# Altium project iMX6 Rex Development Baseboard V1I1.PrjPcb (part 2 of 5)

## Sheet [09] - USB.SchDoc
size A2; DocumentNumber: 2; SheetNumber: 9; SheetTotal: 20
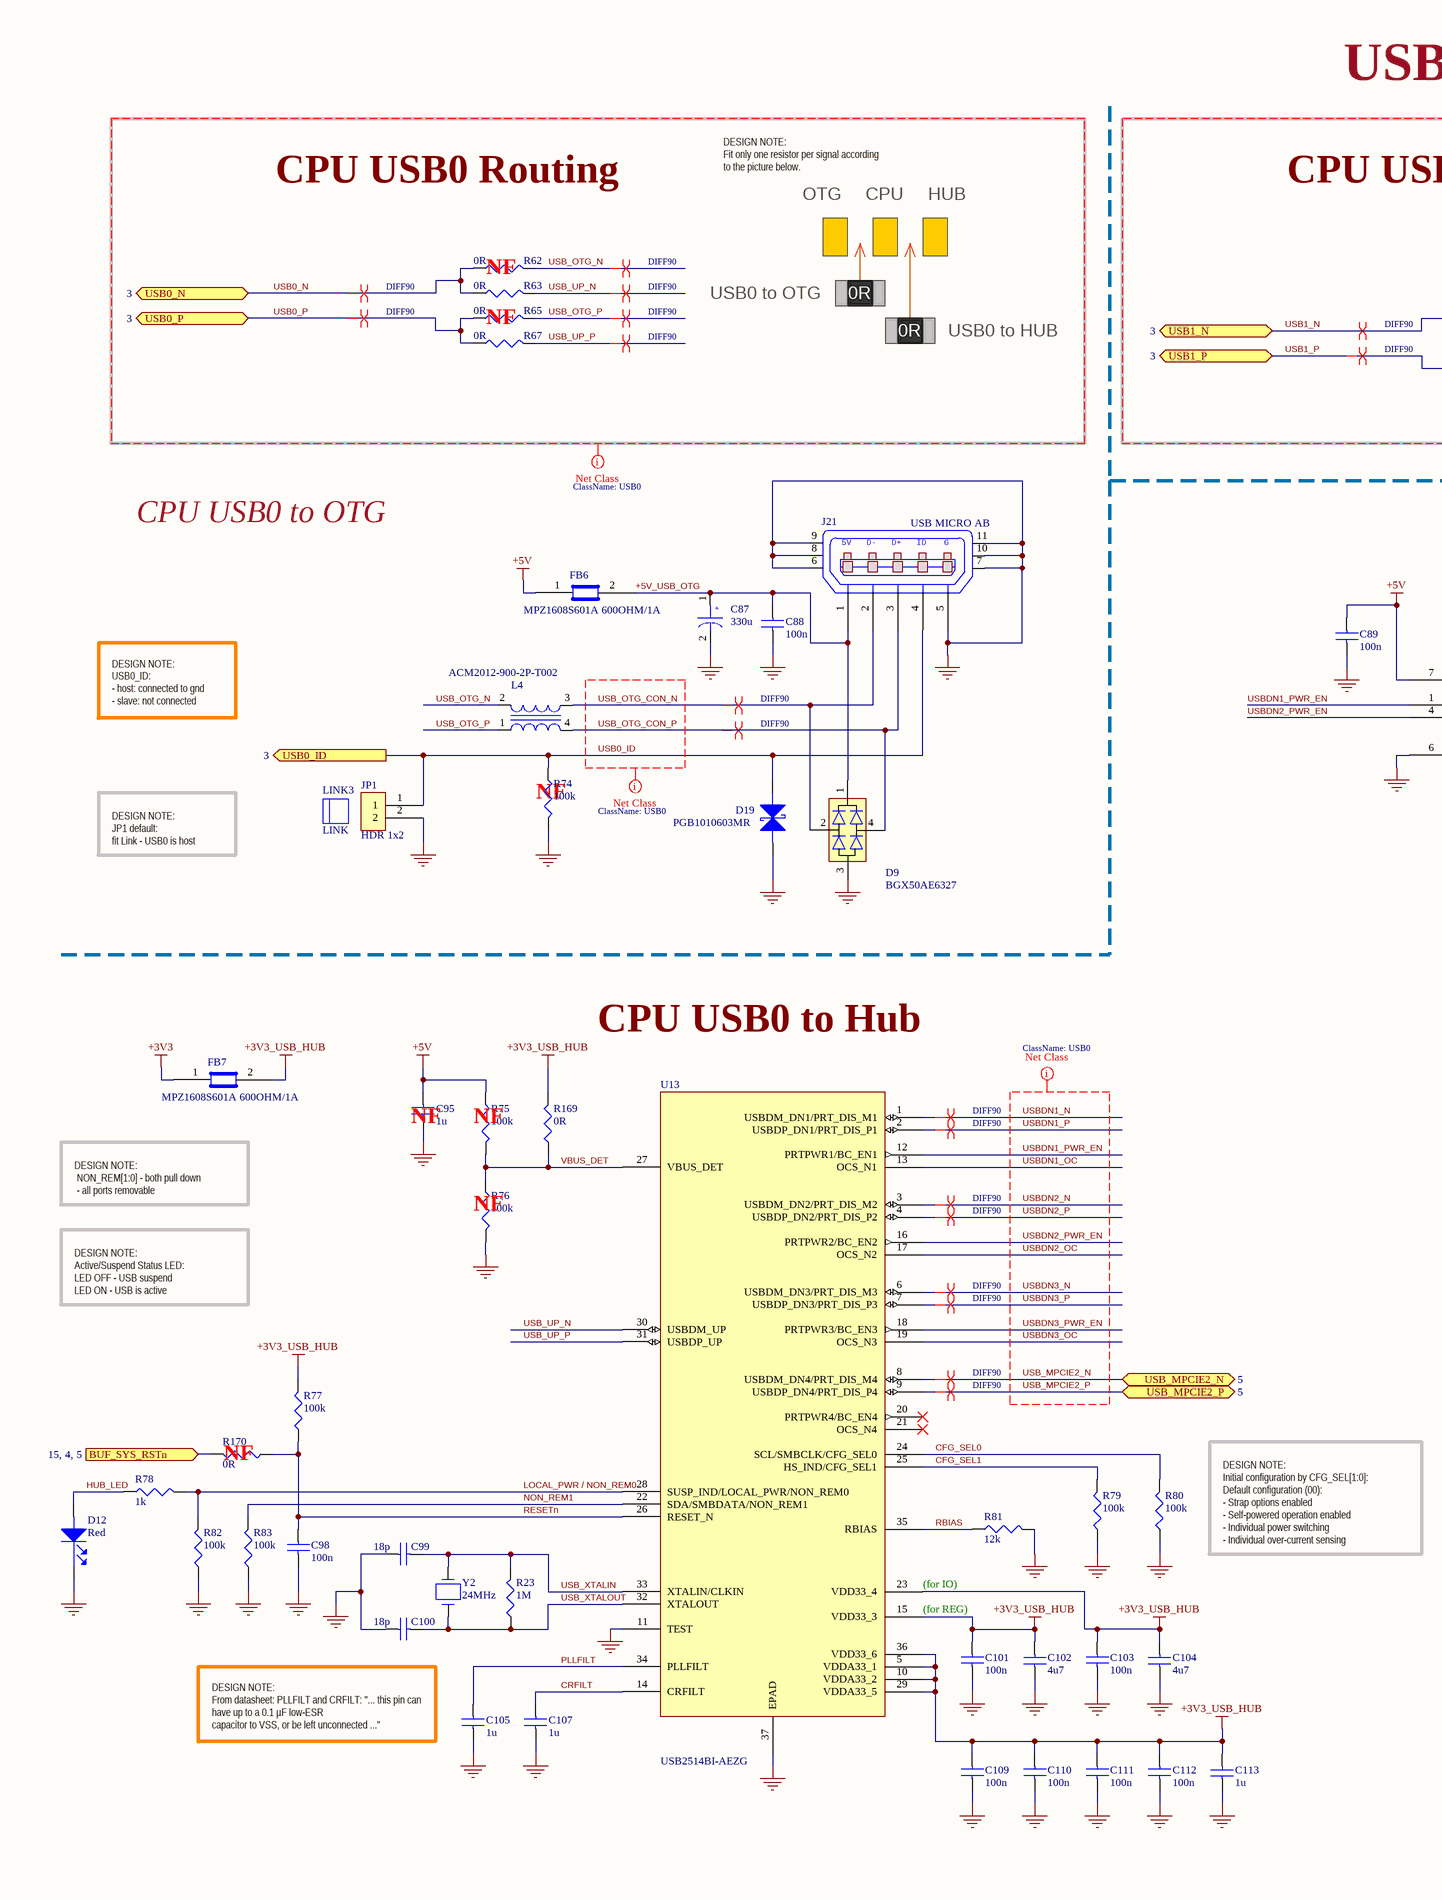
[diagram p4: [09] - USB.SchDoc, left]
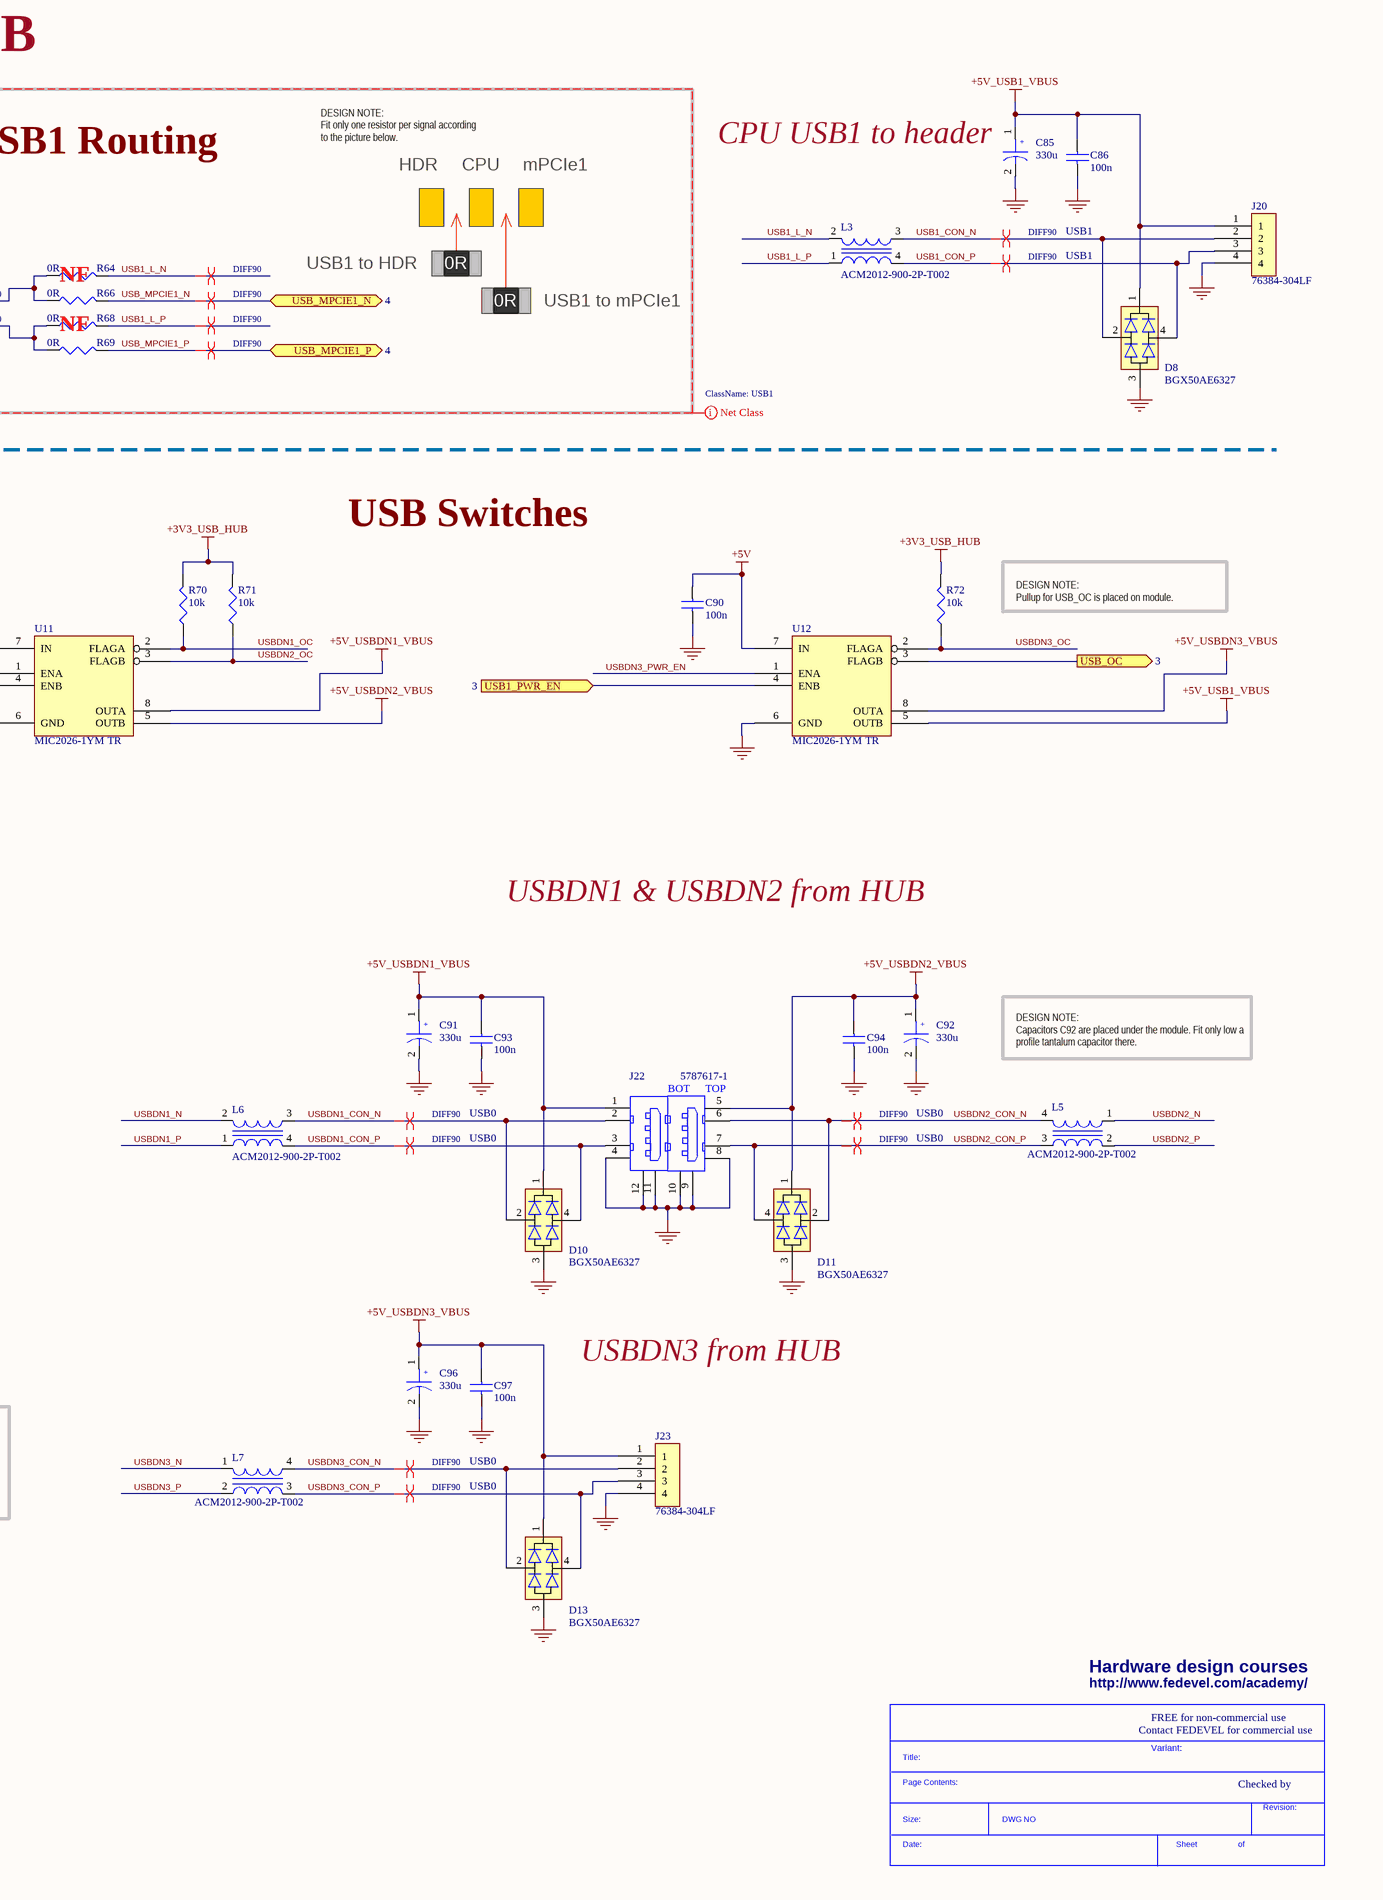
[diagram p5: [09] - USB.SchDoc, right]

### Parts
(Parts that share a designator on the sheet are numbered #1, #2 ... from top to bottom, then left to right.)
*#4  SDTitleBlock  (value not drawn)  (graphical)
C85  330u  [C2917]
C86  100n  [C0402]
C87  330u  [C2917]
C88  100n  [C0402]
C89  100n  [C0402]
C90  100n  [C0402]
C91  330u  [C2917]
C92  330u  [C2917]
C93  100n  [C0402]
C94  100n  [C0402]
C95  1u  [C0402]
C96  330u  [C2917]
C97  100n  [C0402]
C98  100n  [C0402]
C99  18p  [C0402]
C100  18p  [C0402]
C101  100n  [C0402]
C102  4u7  [C0402]
C103  100n  [C0402]
C104  4u7  [C0402]
C105  1u  [C0402]
C107  1u  [C0402]
C109  100n  [C0402]
C110  100n  [C0402]
C111  100n  [C0402]
C112  100n  [C0402]
C113  1u  [C0402]
D8  BGX50AE6327  [SOT143]
D9  BGX50AE6327  [SOT143]
D10  BGX50AE6327  [SOT143]
D11  BGX50AE6327  [SOT143]
D12  Red  [LED_0603]
D13  BGX50AE6327  [SOT143]
D19  PGB1010603MR  [C0603]
FB6  MPZ1608S601A 600OHM/1A  [C0603]
FB7  MPZ1608S601A 600OHM/1A  [C0603]
J20  76384-304LF  [HDR_1x4_2.54MM_SHDR]
J21  USB MICRO AB  [USB_Micro_AB]
J22  5787617-1  [USB-2A]
J23  76384-304LF  [HDR_1x4_2.54MM_SHDR]
JP1  HDR 1x2  [HDR_1x2_2.54MM]
L3  ACM2012-900-2P-T002  [ACM2012]
L4  ACM2012-900-2P-T002  [ACM2012]
L5  ACM2012-900-2P-T002  [ACM2012]
L6  ACM2012-900-2P-T002  [ACM2012]
L7  ACM2012-900-2P-T002  [ACM2012]
LINK3  LINK  (mechanical)
R23  1M  [R0402]
R62  0R  [R0402]
R63  0R  [R0402]
R64  0R  [R0402]
R65  0R  [R0402]
R66  0R  [R0402]
R67  0R  [R0402]
R68  0R  [R0402]
R69  0R  [R0402]
R70  10k  [R0402]
R71  10k  [R0402]
R72  10k  [R0402]
R74  100k  [R0402]
R75  100k  [R0402]
R76  100k  [R0402]
R77  100k  [R0402]
R78  1k  [R0402]
R79  100k  [R0402]
R80  100k  [R0402]
R81  12k  [R0402]
R82  100k  [R0402]
R83  100k  [R0402]
R169  0R  [R0402]
R170  0R  [R0402]
U11  MIC2026-1YM TR  [8_SOIC_3.9MM]
U12  MIC2026-1YM TR  [8_SOIC_3.9MM]
U13  USB2514BI-AEZG  [QFN36_6mmx6mm]
Y2  24MHz  [ABM7_v1_1]

### Blocks framed on the sheet
CPU USB0 Routing: R62 R63 R65 R67
CPU USB1 Routing: R64 R66 R68 R69

### Ports
BUF_SYS_RSTn (see 15, 4, 5), USB0_ID (out, see 3), USB0_N (bidir, see 3), USB0_P (bidir, see 3), USB1_N (bidir, see 3), USB1_P (bidir, see 3), USB1_PWR_EN (in, see 3), USB_MPCIE1_N (bidir, see 4), USB_MPCIE1_P (bidir, see 4), USB_MPCIE2_N (bidir, see 5), USB_MPCIE2_P (bidir, see 5), USB_OC (out, see 3)

### Nets
+3V3: FB7.1
+3V3_USB_HUB: C101.1 C102.2 C103.1 C104.2 C109.1 C110.1 C111.1 C112.1 C113.2 FB7.2 R70.2 R71.2 R72.2 R77.2 R169.2 U13.5(VDDA33_1) U13.10(VDDA33_2) U13.15(VDD33_3) U13.23(VDD33_4) U13.29(VDDA33_5) U13.36(VDD33_6)
+5V: C89.1 C90.1 C95.1 FB6.1 R75.1 U11.7(IN) U12.7(IN)
+5V_USB1_VBUS: C85.1 C86.1 D8.1 J20.1 U12.5(OUTB)
+5V_USBDN1_VBUS: C91.1 C93.1 D10.1 J22.1(VBUS) U11.8(OUTA)
+5V_USBDN2_VBUS: C92.1 C94.1 D11.1 J22.5(VBUS2) U11.5(OUTB)
+5V_USBDN3_VBUS: C96.1 C97.1 D13.1 J23.1 U12.8(OUTA)
GND: C85.2 C86.2 C87.2 C88.2 C89.2 C90.2 C91.2 C92.2 C93.2 C94.2 C95.2 C96.2 C97.2 C98.2 C99.1 C100.1 C101.2 C102.1 C103.2 C104.1 C105.2 C107.2 C109.2 C110.2 C111.2 C112.2 C113.1 D8.3 D9.3 D10.3 D11.3 D12.1(cathode) D13.3 D19.2 J20.4 J21.5(P5) J21.6 J21.7 J21.8 J21.9 J21.10 J21.11 J22.4(GND) J22.8(GND) J22.9(SHIELD) J22.10(SHIELD) J22.11(SHIELD) J22.12(SHIELD) J23.4 JP1.2 R74.2 R76.2 R79.1 R80.1 R81.2 R82.1 R83.1 U11.6(GND) U12.6(GND) U13.11(TEST) U13.37(EPAD)
+5V_USB_OTG: C87.1 C88.1 D9.1 FB6.2 J21.1(P1)
BUF_SYS_RSTn: R170.2 ; port BUF_SYS_RSTn
CFG_SEL0: R80.2 U13.24(SCL/SMBCLK/CFG_SEL0)
CFG_SEL1: R79.2 U13.25(HS_IND/CFG_SEL1)
CRFILT: C107.1 U13.14(CRFILT)
HUB_LED: D12.2(ANODE) R78.1
LOCAL_PWR / NON_REM0: R78.2 R82.2 U13.28(SUSP_IND/LOCAL_PWR/NON_REM0)
NON_REM1: R83.2 U13.22(SDA/SMBDATA/NON_REM1)
PLLFILT: C105.1 U13.34(PLLFILT)
RBIAS: R81.1 U13.35(RBIAS)
RESETn: C98.1 R77.1 R170.1 U13.26(RESET_N)
USB0_ID: D19.1 J21.4(P4) JP1.1 R74.1 ; port USB0_ID
USB0_N: R62.1 R63.1 ; port USB0_N
USB0_P: R65.1 R67.1 ; port USB0_P
USB1_CON_N: D8.2 J20.2 L3.3
USB1_CON_P: D8.4 J20.3 L3.4
USB1_L_N: L3.2 R64.2
USB1_L_P: L3.1 R68.2
USB1_N: R64.1 R66.1 ; port USB1_N
USB1_P: R68.1 R69.1 ; port USB1_P
USB1_PWR_EN: U12.4(ENB) ; port USB1_PWR_EN
USB_MPCIE1_N: R66.2 ; port USB_MPCIE1_N
USB_MPCIE1_P: R69.2 ; port USB_MPCIE1_P
USB_MPCIE2_N: U13.8(USBDM_DN4/PRT_DIS_M4) ; port USB_MPCIE2_N
USB_MPCIE2_P: U13.9(USBDP_DN4/PRT_DIS_P4) ; port USB_MPCIE2_P
USB_OC: U12.3(FLAGB) ; port USB_OC
USB_OTG_CON_N: D9.2 J21.2(P2) L4.3
USB_OTG_CON_P: D9.4 J21.3(P3) L4.4
USB_OTG_N: L4.2 R62.2
USB_OTG_P: L4.1 R65.2
USB_UP_N: R63.2 U13.30(USBDM_UP)
USB_UP_P: R67.2 U13.31(USBDP_UP)
USB_XTALIN: C99.2 R23.2 U13.33(XTALIN/CLKIN) Y2.2
USB_XTALOUT: C100.2 R23.1 U13.32(XTALOUT) Y2.1
USBDN1_CON_N: D10.2 J22.2(D-) L6.3
USBDN1_CON_P: D10.4 J22.3(D+) L6.4
USBDN1_N: L6.2 U13.1(USBDM_DN1/PRT_DIS_M1)
USBDN1_OC: R70.1 U11.2(FLAGA) U13.13(OCS_N1)
USBDN1_P: L6.1 U13.2(USBDP_DN1/PRT_DIS_P1)
USBDN1_PWR_EN: U11.1(ENA) U13.12(PRTPWR1/BC_EN1)
USBDN2_CON_N: D11.2 J22.6(D2-) L5.4
USBDN2_CON_P: D11.4 J22.7(D2+) L5.3
USBDN2_N: L5.1 U13.3(USBDM_DN2/PRT_DIS_M2)
USBDN2_OC: R71.1 U11.3(FLAGB) U13.17(OCS_N2)
USBDN2_P: L5.2 U13.4(USBDP_DN2/PRT_DIS_P2)
USBDN2_PWR_EN: U11.4(ENB) U13.16(PRTPWR2/BC_EN2)
USBDN3_CON_N: D13.2 J23.2 L7.4
USBDN3_CON_P: D13.4 J23.3 L7.3
USBDN3_N: L7.1 U13.6(USBDM_DN3/PRT_DIS_M3)
USBDN3_OC: R72.1 U12.2(FLAGA) U13.19(OCS_N3)
USBDN3_P: L7.2 U13.7(USBDP_DN3/PRT_DIS_P3)
USBDN3_PWR_EN: U12.1(ENA) U13.18(PRTPWR3/BC_EN3)
VBUS_DET: R75.2 R76.1 R169.1 U13.27(VBUS_DET)

Not connected (* = marked no-connect by the designer): U13 20(PRTPWR4/BC_EN4)* 21(OCS_N4)*

### Layout directives
differential pair; net class DIFF90: USB0_N, USB0_P, USB1_L_N, USB1_L_P, USB1_N, USB1_P, USB_MPCIE1_N, USB_MPCIE1_P, USB_MPCIE2_N, USB_MPCIE2_P, USB_OTG_CON_N, USB_OTG_CON_P, USB_OTG_N, USB_OTG_P, USB_UP_N, USB_UP_P, USBDN1_N, USBDN1_P, USBDN2_N, USBDN2_P, USBDN3_N, USBDN3_P
net class USB0: USB0_ID, USB0_N, USB0_P, USB_MPCIE2_N, USB_MPCIE2_P, USB_OTG_CON_N, USB_OTG_CON_P, USB_OTG_N, USB_OTG_P, USB_UP_N, USB_UP_P, USBDN1_N, USBDN1_OC, USBDN1_P, USBDN1_PWR_EN, USBDN2_N, USBDN2_OC, USBDN2_P, USBDN2_PWR_EN, USBDN3_N, USBDN3_OC, USBDN3_P, USBDN3_PWR_EN
net class USB1: USB1_L_N, USB1_L_P, USB1_N, USB1_P, USB_MPCIE1_N, USB_MPCIE1_P
differential pair; net class DIFF90; net class USB1: USB1_CON_N, USB1_CON_P
differential pair; net class DIFF90; net class USB0: USBDN1_CON_N, USBDN1_CON_P, USBDN2_CON_N, USBDN2_CON_P, USBDN3_CON_N, USBDN3_CON_P

### Notes on the sheet
- USB
- DESIGN NOTE:
  Fit only one resistor per signal according to the picture below.
- OTG
- CPU
- HUB
- HDR
- mPCIe1
- (near C85) CPU USB1 to header
- (near R62) NF
- (near R65) NF
- USB0 to OTG
- 0R
- USB0 to HUB
- (near R64) NF
- USB1 to HDR
- USB1 to mPCIe1
- (near R68) NF
- CPU USB0 to OTG
- USB Switches
- DESIGN NOTE:
  Pullup for USB_OC is placed on module.
- DESIGN NOTE:
  USB0_ID:
  - host: connected to gnd
  - slave: not connected
- (near R74) NF
- DESIGN NOTE:
  JP1 default:
  fit Link - USB0 is host
- USBDN1 & USBDN2 from HUB
- CPU USB0 to Hub
- (near C95) NF
- (near R75) NF
- DESIGN NOTE:
  Capacitors C92 are placed under the module. Fit only low a profile tantalum capacitor there.
- DESIGN NOTE:
  NON_REM[1:0] - both pull down
  - all ports removable
- (near R76) NF
- DESIGN NOTE:
  Active/Suspend Status LED:
  LED OFF - USB suspend
  LED ON - USB is active
- USBDN3 from HUB
- (near R170) NF
- (for IO)
- DESIGN NOTE:
  Initial configuration by CFG_SEL[1:0]:
  Default configuration (00):
  - Strap options enabled
  - Self-powered operation enabled
  - Individual power switching
  - Individual over-current sensing
- (for REG)
- Hardware design courses
- DESIGN NOTE:
  From datasheet: PLLFILT and CRFILT: "... this pin can have up to a 0.1 µF low-ESR
  capacitor to VSS, or be left unconnected ..."
- http://www.fedevel.com/academy/
- Contact FEDEVEL for commercial use
- FREE for non-commercial use
- Variant:
- Checked by
- (in symbol 5787617-1) BOT; TOP
- (in symbol 0475890001) 5V; D-; D+; ID; G
- (in symbol SDTitleBlock) Title:; Page Contents:; Revision:; Size:; DWG NO; Date:; Sheet; of
- (in symbol T495D337K010ATE150) +

### Library data of the parts
C85 C87 C91 C92 C96 = T495D337K010ATE150: CAP TANT 330UF 10V 10% 2917; Manufacturer: Kemet; Manufacturer Size Code: D; Capacitance: 330µF; ESR (Equivalent Series Resistance): 150 mOhm; Type: Molded; .Creator: MM; .Checked SCH: RF, used by MM; Supplier 1: Digi-Key; Manufacturer Part Number: T495D337K010ATE150; RoHS: RoHS Compliant; Category: Capacitors; Stock 1: 272; Pricing 1: 1=1.84, 10=1.455, 50=1.2612, 100=1.0915, 250=0.9702 (USD); Packaging: Cut Tape (CT); Voltage - Rated: 10V; Tolerance: ±10%; Operating Temperature: -55°C ~ 125°C; Mounting Type: Surface Mount; Package / Case: 2917 (7343 Metric); Size / Dimension: 0.287" L x 0.169" W (7.30mm x 4.30mm); Height - Seated (Max): 0.122" (3.10mm); Lead Spacing: -; Features: General Purpose; Lifetime @ Temp.: -; ComponentLink1URL: http://www.kemet.com/kemet/web/homepage/kechome.nsf/vapubfiles/KEM_T2009_T495.pdf/$file/KEM_T2009_T495.pdf; ComponentLink1Description: http://www.kemet.com/kemet/web/homepage/kechome.nsf/vapubfiles/KEM_T2009_T495.pdf/$file/KEM_T2009_T495.pdf; Supplier Part Number 1: 399-10511-1-ND; .Checked PCB: MM
C86 C88-C90 C93 C94 C97 C98 C101 C103 C109-C112 = C1005X5R1H104K: CAP CER .10UF 50V X5R 10% 0402; Manufacturer: TDK Corporation; Capacitance: 0.1µF; Value: 100nF; .Checked PCB: used; Description: CAP CER 0.1UF 50V 10% X5R 0402; Category: Capacitors; Supplier Part Number: 445-5942-1-ND; Manufacturer Part Number: C1005X5R1H104K; Operating Temperature: -55°C ~ 85°C; Package / Case: 0402 (1005 Metric); Price 1k [$]: 0.02340; .Checked SCH: used; Voltage - Rated: 50V; Supplier: Digikey; Supplier 1: Digi-Key; Supplier Part Number 1: 445-5942-1-ND; RoHS: RoHS Compliant; Stock 1: 106926; Pricing 1: 1=0.27, 10=0.18, 100=0.072, 250=0.05176, 500=0.0369, 1000=0.027 (USD); Tolerance: ±10%; Temperature Coefficient: X5R; Mounting Type: Surface Mount, MLCC; Applications: General Purpose; Ratings: -; Size / Dimension: 0.039" L x 0.020" W (1.00mm x 0.50mm); Height - Seated (Max): -; Thickness (Max): 0.022" (0.55mm); Lead Spacing: -; Features: -; Packaging: Cut Tape (CT); Lead Style: -; ComponentLink1URL: http://www.tdk.co.jp/tefe02/e412_c.pdf; ComponentLink1Description: http://www.tdk.co.jp/tefe02/e412_c.pdf
C95 C105 C107 C113 = C1005X5R1C105K: CAP CER 1.0UF 16V X5R 0402; Manufacturer: TDK Corporation; Capacitance: 1.0µF; Value: 1uF; .Checked PCB: used; Description: CAP CER 1UF 16V 10% X5R 0402; Tolerance: ±10%; Category: Capacitors; Supplier Part Number: 445-4978-1-ND; Manufacturer Part Number: C1005X5R1C105K; Operating Temperature: -55°C ~ 85°C; Package / Case: 0402 (1005 Metric); Price 1k [$]: 0.02080; .Checked SCH: used; Voltage - Rated: 16V; Supplier: Digikey; Supplier 1: Digi-Key; Supplier Part Number 1: 445-4978-1-ND; RoHS: RoHS Compliant; Stock 1: 341010; Pricing 1: 1=0.24, 10=0.16, 100=0.064, 250=0.046, 500=0.0328, 1000=0.024 (USD); Temperature Coefficient: X5R; Mounting Type: Surface Mount, MLCC; Applications: General Purpose; Ratings: -; Size / Dimension: 0.039" L x 0.020" W (1.00mm x 0.50mm); Height - Seated (Max): -; Thickness (Max): 0.022" (0.55mm); Lead Spacing: -; Features: -; Packaging: Cut Tape (CT); Lead Style: -; ComponentLink1URL: http://www.tdk.co.jp/tefe02/e412_c.pdf; ComponentLink1Description: http://www.tdk.co.jp/tefe02/e412_c.pdf
C99 C100 = C1005C0G1H180J: CAP CER 18PF 50V C0G 5% 0402; Manufacturer: TDK Corporation; .Checked PCB: used; Description: CAP CER 18PF 50V 5% NP0 0402; Temperature Coefficient: C0G, NP0; Capacitance: 18pF; Category: Capacitors; Supplier Part Number: 445-1238-1-ND; Manufacturer Part Number: C1005C0G1H180J; Operating Temperature: -55°C ~ 125°C; Package / Case: 0402 (1005 Metric); Price 1k [$]: 0.00468; Value: 18pF; .Checked SCH: used; Voltage - Rated: 50V; Supplier: Digikey; Supplier 1: Digi-Key; Supplier Part Number 1: 445-1238-1-ND; RoHS: RoHS Compliant; Stock 1: 24321; Pricing 1: 1=0.08, 10=0.05, 100=0.018, 250=0.013, 500=0.0096, 1000=0.0065 (USD); Tolerance: ±5%; Mounting Type: Surface Mount, MLCC; Applications: General Purpose; Ratings: -; Size / Dimension: 0.039" L x 0.020" W (1.00mm x 0.50mm); Height - Seated (Max): -; Thickness (Max): 0.022" (0.55mm); Lead Spacing: -; Features: -; Packaging: Cut Tape (CT); Lead Style: -; ComponentLink1URL: http://www.tdk.co.jp/tefe02/e412_c.pdf; ComponentLink1Description: http://www.tdk.co.jp/tefe02/e412_c.pdf
C102 C104 = C1005X5R1A475M: CAP CER 4.7UF 10V 20% X5R 0402; Manufacturer: TDK Corporation; Capacitance: 4.7µF; .Checked PCB: RF; Supplier 1: Digi-Key; Supplier Part Number 1: 445-8023-1-ND; Manufacturer Part Number: C1005X5R1A475M; RoHS: RoHS Compliant; Category: Capacitors; Stock 1: 10140; Pricing 1: 1=0.53, 10=0.415, 100=0.25, 250=0.18752, 500=0.16, 1000=0.125, 5000=0.095 (USD); Voltage - Rated: 10V; Tolerance: ±20%; Temperature Coefficient: X5R; Mounting Type: Surface Mount, MLCC; Operating Temperature: -55°C ~ 85°C; Applications: General Purpose; Ratings: -; Package / Case: 0402 (1005 Metric); Size / Dimension: 0.039" L x 0.020" W (1.00mm x 0.50mm); Height - Seated (Max): -; Thickness (Max): -; Lead Spacing: -; Features: -; Packaging: Cut Tape (CT); Lead Style: -; ComponentLink1URL: http://www.tdk.com/pdf/general_B11.pdf; ComponentLink1Description: http://www.tdk.com/pdf/general_B11.pdf; .Checked SCH: RF
D8-D11 D13 = BGX50AE6327: DIODE SWITCHING 50V SOT-143; Manufacturer: Infineon Technologies; .Checked PCB: used; Current - DC Forward (If): 140mA; Diode Type: Single Phase; Speed: Small Signal =< 200mA (Io), Any Speed; Reverse Recovery Time (trr): 6ns; .Checked SCH: used; Category: Discrete Semiconductor Products; Family: Bridge Rectifiers; Manufacturer Part Number: BGX50AE6327; Package / Case: TO-253-4, TO-253AA; Price 1k [$]: 0.10013; Supplier: Digikey; Supplier Part Number: BGX50AINCT-ND; Value: BGX50AE6327; Supplier 1: Digi-Key; Supplier Part Number 1: BGX50AINCT-ND; RoHS: RoHS Compliant; Stock 1: 438; Pricing 1: 1=0.47, 10=0.334, 100=0.2225, 500=0.12906, 1000=0.10013 (USD); Voltage - Peak Reverse (Max): 50V; Mounting Type: Surface Mount; Packaging: Cut Tape (CT); Supplier Device Package: PG-SOT143-4; ComponentLink1URL: http://www.infineon.com/dgdl/bgx50aseries.pdf?folderId=db3a30431400ef6801141cc1c4cd04e8&fileId=db3a30431400ef6801141cc423c404e9; ComponentLink1Description: http://www.infineon.com/dgdl/bgx50aseries.pdf?folderId=db3a30431400ef6801141cc1c4cd04e8&fileId=db3a30431400ef6801141cc423c404e9
D12 = LS L29K-H1J2-1-Z: LED SMARTLED RED 630NM 0603 SMD; Manufacturer: OSRAM Opto Semiconductors Inc; Millicandela Rating: 4.95mcd; Voltage - Forward (Vf) Typ: 1.8V; Current - Test: 2mA; Wavelength - Peak: 643nm; Viewing Angle: 160°; Lens Type: Diffused; Lens Style/Size: Rectangle with Flat Top, 1.3mm x 0.8mm; Luminous Flux @ Current - Test: 20 mlm; .Checked PCB: RF; Supplier 1: Digi-Key; Supplier Part Number 1: 475-1195-1-ND; Manufacturer Part Number: LS L29K-H1J2-1-Z; RoHS: RoHS Compliant; Category: Optoelectronics; Stock 1: 71670; Pricing 1: 1=0.16, 10=0.137, 100=0.1093, 250=0.09564, 500=0.08744 (USD); Color: Red; Wavelength - Dominant: 630nm; Package / Case: 0603 (1608 Metric); Size / Dimension: 1.70mm L x 0.80mm W; Height: 0.65mm; Mounting Type: Surface Mount; Packaging: Cut Tape (CT); ComponentLink1URL: http://catalog.osram-os.com/catalogue/catalogue.do;jsessionid=DB7CFDBAC5AF1E216E45F622E867085A?act=downloadFile&favOid=020000010003f9de000100b6; ComponentLink1Description: http://catalog.osram-os.com/catalogue/catalogue.do;jsessionid=DB7CFDBAC5AF1E216E45F622E867085A?act=downloadFile&favOid=020000010003f9de000100b6; .Checked SCH: RF
D19 = PGB1010603MR: SUPPRESSOR ESD 24VDC 0603 SMD; Manufacturer: Littelfuse Inc; Voltage - Reverse Standoff (Typ): 24V; Polarization: Bidirectional; .Creator: MM; Supplier 1: Digi-Key; Manufacturer Part Number: PGB1010603MR; RoHS: RoHS Compliant; Category: Circuit Protection; Stock 1: 155406; Pricing 1: 1=0.66, 10=0.556, 25=0.4872, 100=0.4172, 250=0.3618, 500=0.30646 (USD); Packaging: Cut Tape (CT); Voltage - Breakdown: -; Power (Watts): -; Mounting Type: Surface Mount; Package / Case: 0603 (1608 Metric); Supplier Device Package: 0603 (1608 Metric); ComponentLink1URL: http://www.littelfuse.com/data/en/Data_Sheets/Littelfuse_PulseGuard-ESD_PGB1.pdf; ComponentLink1Description: http://www.littelfuse.com/data/en/Data_Sheets/Littelfuse_PulseGuard-ESD_PGB1.pdf; Supplier Part Number 1: F2594CT-ND; .Checked PCB: MM; .Checked SCH: MM
FB6 FB7 = MPZ1608S601A: FERRITE CHIP BEAD 600 OHM SMD 1A; Manufacturer: TDK Corporation; Impedance @ Frequency: 600 Ohm @ 100MHz; DC Resistance (DCR): 150 mOhm Max; Filter Type: Differential Mode - Single; Number of Lines: 1; .Checked PCB: RF; Supplier 1: Digi-Key; Supplier Part Number 1: 445-2205-1-ND; Manufacturer Part Number: MPZ1608S601A; RoHS: RoHS Compliant; Description: FERRITE CHIP BEAD 600 OHM SMD; Category: Filters; Stock 1: 328345; Pricing 1: 1=0.36, 10=0.24, 100=0.096, 250=0.069, 500=0.0492, 1000=0.036 (USD); Current Rating: 1A; Package / Case: 0603 (1608 Metric); Mounting Type: Surface Mount; Packaging: Cut Tape (CT); Height (Max): 0.037" (0.95mm); Size / Dimension: 0.063" L x 0.031" W (1.60mm x 0.80mm); ComponentLink1URL: http://www.tdk.co.jp/tefe02/e9413_mpz.pdf; ComponentLink1Description: http://www.tdk.co.jp/tefe02/e9413_mpz.pdf; .Checked SCH: RF
J20 J23 = 76384-304LF: CONN HEADER 4POS .100" STR GOLD; Manufacturer: FCI; Connector Type: Header, Shrouded; Number of Positions: 4; Number of Positions Loaded: All; Pitch: 0.100" (2.54mm); .Checked PCB: RF; Supplier 1: Digi-Key; Supplier Part Number 1: 609-1306-ND; Manufacturer Part Number: 76384-304LF; RoHS: RoHS Compliant; Category: Connectors, Interconnects; Stock 1: 2388; Pricing 1: 1=1.09, 10=0.762, 100=0.5116, 250=0.4354, 500=0.41364, 1000=0.37009, 5000=0.28954, 10000=0.28301, 25000=0.27213 (USD); Contact Type: Male Pin; Number of Rows: 1; Row Spacing: -; Contact Mating Length: 0.197" (5.00mm); Mounting Type: Through Hole; Termination: Solder; Fastening Type: Friction Lock; Features: -; Contact Finish: Gold, GXT™; Contact Finish Thickness: 30µin (0.76µm); Color: Black; Packaging: Tube; ComponentLink1URL: http://portal.fciconnect.com/res/en/pdffiles/doc_search/76384.pdf; ComponentLink1Description: http://portal.fciconnect.com/res/en/pdffiles/doc_search/76384.pdf; .Checked SCH: RF
J21 = 0475890001: CONN RCPT MICRO USB AB R/A SMD; Manufacturer: Molex Inc; Connector Type: USB - micro AB; Number of Contacts: 5; Gender: Receptacle; .Creator: MM; Supplier 1: Digi-Key; Manufacturer Part Number: 0475890001; RoHS: RoHS Compliant; Category: Connectors, Interconnects; Stock 1: 12754; Pricing 1: 1=0.81, 10=0.764, 25=0.6872, 50=0.6108, 100=0.5854, 250=0.53452, 500=0.50908 (USD); Packaging: Cut Tape (CT); Specifications: -; Mounting Type: Surface Mount, Right Angle, Horizontal; Features: Board Guide, Shielded; Ingress Protection: -; ComponentLink1URL: http://www.molex.com/pdm_docs/sd/475890001_sd.pdf; ComponentLink1Description: http://www.molex.com/pdm_docs/sd/475890001_sd.pdf; Supplier Part Number 1: WM17143CT-ND; .Checked PCB: MM; .Checked SCH: MM
J22 = 5787617-1: CONN RCPT R/A 4OVER4POS GOLD PCB; Manufacturer: TE Connectivity; .Checked PCB: used; Connector Type: USB - A, Stacked; Number of Contacts: 8; Gender: Receptacle; Specifications: USB 2.0; .Checked SCH: used; Category: Connectors, Interconnects; Family: USB, IEEE-1394 (Firewire), DVI, HDMI; Manufacturer Part Number: 5787617-1; Price 1k [$]: 1.68753; Supplier: Digikey; Supplier Part Number: A31728-ND; Value: 5787617-1; Supplier 1: Digi-Key; Supplier Part Number 1: A31728-ND; RoHS: RoHS Compliant; Stock 1: 5401; Pricing 1: 1=3.33, 10=3.197, 25=2.9308, 50=2.7978, 100=2.6645, 250=2.33144, 500=2.26484, 1000=1.93178, 2500=1.79855 (USD); Mounting Type: Through Hole, Right Angle, Horizontal; Features: Board Lock; Packaging: Tray; Ingress Protection: -; ComponentLink1URL: http://documents.tycoelectronics.com/commerce/DocumentDelivery/DDEController?Action=srchrtrv&DocNm=5787617&DocType=CD&DocLang=EN; ComponentLink1Description: http://documents.tycoelectronics.com/commerce/DocumentDelivery/DDEController?Action=srchrtrv&DocNm=5787617&DocType=CD&DocLang=EN
JP1 = 68001-202HLF: BERGSTIK II .100" SR STRAIGHT; Manufacturer: FCI; Connector Type: Header, Unshrouded; Number of Positions: 2; Number of Positions Loaded: All; Pitch: 0.100" (2.54mm); .Checked PCB: RF; Supplier 1: Digi-Key; Supplier Part Number 1: 609-3469-ND; Manufacturer Part Number: 68001-202HLF; RoHS: RoHS Compliant; Category: Connectors, Interconnects; Stock 1: 13680; Pricing 1: 1=0.45, 10=0.265, 100=0.1172, 250=0.09828, 500=0.09072, 1000=0.07938, 5000=0.05065 (USD); Contact Type: Male Pin; Number of Rows: 1; Row Spacing: -; Contact Mating Length: 0.230" (5.84mm); Mounting Type: Through Hole; Termination: Solder; Fastening Type: -; Features: -; Contact Finish: Gold; Contact Finish Thickness: 15µin (0.38µm); Color: Black; Packaging: Bulk; ComponentLink1URL: http://portal.fciconnect.com/res/en/pdffiles/doc_search/68000.pdf; ComponentLink1Description: http://portal.fciconnect.com/res/en/pdffiles/doc_search/68000.pdf; .Checked SCH: RF
L3-L7 = ACM2012-900-2P-T002: CHOKE COMM MODE 90 OHM .4A SMD; Manufacturer: TDK Corporation; Filter Type: Data, Signal Line; Number of Lines: 2; Current: 400mA; DC Resistance (DCR): 190 mOhm Max; Impedance: 90 Ohm; Resistance (Ohms): 8.2K; Power (Watts): 0.063W, 1/16W; Temperature Coefficient: ±100ppm/°C; Tolerance: ±1%; .Checked PCB: RF; Supplier 1: Digi-Key; Supplier Part Number 1: 445-2207-1-ND; Manufacturer Part Number: ACM2012-900-2P-T002; RoHS: RoHS Compliant; Category: Filters; Stock 1: 175768; Pricing 1: 1=0.48, 10=0.448, 50=0.42, 100=0.364, 500=0.308, 1000=0.252 (USD); Inductance: -; Mounting Type: Surface Mount; Size / Dimension: 0.079" L x 0.047" W (2.00mm x 1.20mm); Height (Max): 0.051" (1.30mm); Package / Case: 0805 (2012 Metric), 4 Lead; Operating Temperature: -25°C ~ 85°C; Packaging: Cut Tape (CT); ComponentLink1URL: http://www.tdk.co.jp/tefe02/e9719_acm2012.pdf; ComponentLink1Description: http://www.tdk.co.jp/tefe02/e9719_acm2012.pdf; Composition: Thick Film; Features: -; Height: 0.016" (0.40mm); Number of Terminations: 2; ComponentLink2URL: http://www.yageo.com/documents/recent/PYu-RC0402_51_RoHS_L_6.pdf; ComponentLink2Description: http://www.yageo.com/documents/recent/PYu-RC0402_51_RoHS_L_6.pdf; .Checked SCH: RF
LINK3 = QPC02SXGN-RC: CONN JUMPER SHORTING .100" GOLD; Manufacturer: Sullins Connector Solutions; Gender: Female Sockets; Number of Positions or Pins (Grid): 2 (1 x 2); Pitch: 0.100" (2.54mm); .Checked SCH: RF; Supplier 1: Digi-Key; Supplier Part Number 1: S9337-ND; Manufacturer Part Number: QPC02SXGN-RC; RoHS: RoHS Compliant; Category: Connectors, Interconnects; Stock 1: 23274; Pricing 1: 1=0.11, 10=0.066, 25=0.0468, 50=0.0384, 100=0.033, 250=0.02792, 500=0.0258, 1000=0.0228, 2500=0.018 (USD); Type: Open Top; Height: 0.235" (5.97mm); Contact Finish: Gold; Contact Finish Thickness: Flash; Color: -; Packaging: Bulk; ComponentLink1URL: http://www.sullinscorp.com/drawings/284_SXGN_11510.pdf; ComponentLink1Description: http://www.sullinscorp.com/drawings/284_SXGN_11510.pdf
R23 = RC0402FR-071ML: RES 1.00M OHM 1/16W 1% 0402 SMD; Manufacturer: Yageo; Power (Watts): 0.063W, 1/16W; .Checked PCB: RF; Temperature Coefficient: ±100ppm/°C; Category: Resistors; Supplier Part Number: 311-1.00MLRCT-ND; Manufacturer Part Number: RC0402FR-071ML; Package / Case: 0402 (1005 Metric); Price 1k [$]: 0.00288; Resistance (Ohms): 1M; Tolerance: ±1%; Value: 1M; .Checked SCH: RF; Supplier: Digikey; Supplier 1: Digi-Key; Supplier Part Number 1: 311-1.00MLRCT-ND; RoHS: RoHS Compliant; Stock 1: 102060; Pricing 1: 10=0.014, 50=0.0104, 100=0.0079, 250=0.00584, 500=0.00432, 1000=0.00288 (USD); Composition: Thick Film; Features: -; Size / Dimension: 0.039" L x 0.020" W (1.00mm x 0.50mm); Height: 0.016" (0.40mm); Number of Terminations: 2; Packaging: Cut Tape (CT); ComponentLink1URL: http://www.yageo.com/documents/recent/PYu-RC0402_51_RoHS_L_6.pdf; ComponentLink1Description: http://www.yageo.com/documents/recent/PYu-RC0402_51_RoHS_L_6.pdf
R62-R69 R169 R170 = RC0402JR-070RL: RES 0.0 OHM 1/16W 0402 SMD; Manufacturer: Yageo; Resistance (Ohms): 0.0; Power (Watts): 0.063W, 1/16W; Tolerance: Jumper; .Checked PCB: used; Category: Resistors; Manufacturer Part Number: RC0402JR-070RL; Package / Case: 0402 (1005 Metric); Price 1k [$]: 0.01389; Value: 0R; .Checked SCH: used; Supplier Part Number: 311-0.0JRCT-ND; Supplier: Digikey; Supplier 1: Digi-Key; Supplier Part Number 1: 311-0.0JRCT-ND; RoHS: RoHS Compliant; Stock 1: 1106330; Pricing 1: 10=0.012, 50=0.009, 100=0.0069, 250=0.00512, 500=0.0038, 1000=0.00253 (USD); Composition: Thick Film; Features: -; Temperature Coefficient: -; Size / Dimension: 0.039" L x 0.020" W (1.00mm x 0.50mm); Height: 0.016" (0.40mm); Number of Terminations: 2; Packaging: Cut Tape (CT); ComponentLink1URL: http://www.yageo.com/documents/recent/PYu-RC0402_51_RoHS_L_6.pdf; ComponentLink1Description: http://www.yageo.com/documents/recent/PYu-RC0402_51_RoHS_L_6.pdf
R70-R72 = RC0402FR-0710KL: RES 10.0K OHM 1/16W 1% 0402 SMD; Manufacturer: Yageo; Power (Watts): 0.063W, 1/16W; .Checked PCB: used; Temperature Coefficient: ±100ppm/°C; Category: Resistors; Supplier Part Number: 311-10.0KLRCT-ND; Manufacturer Part Number: RC0402FR-0710KL; Package / Case: 0402 (1005 Metric); Price 1k [$]: 0.01421; Resistance (Ohms): 10K; Tolerance: ±1%; Value: 10k; .Checked SCH: used; Supplier: Digikey; Supplier 1: Digi-Key; Supplier Part Number 1: 311-10.0KLRCT-ND; RoHS: RoHS Compliant; Stock 1: 2916495; Pricing 1: 10=0.014, 50=0.0104, 100=0.0079, 250=0.00584, 500=0.00432, 1000=0.00288 (USD); Composition: Thick Film; Features: -; Size / Dimension: 0.039" L x 0.020" W (1.00mm x 0.50mm); Height: 0.016" (0.40mm); Number of Terminations: 2; Packaging: Cut Tape (CT); ComponentLink1URL: http://www.yageo.com/documents/recent/PYu-RC0402_51_RoHS_L_6.pdf; ComponentLink1Description: http://www.yageo.com/documents/recent/PYu-RC0402_51_RoHS_L_6.pdf
R74-R77 R79 R80 R82 R83 = RMCF0402FT100K: RES 100K OHM 1/16W 1% 0402 SMD; Manufacturer: Stackpole Electronics Inc; Power (Watts): 0.063W, 1/16W; .Checked PCB: used; Temperature Coefficient: ±100ppm/°C; Category: Resistors; Supplier Part Number: RMCF0402FT100KCT-ND; Manufacturer Part Number: RMCF0402FT100K; Package / Case: 0402 (1005 Metric); Price 1k [$]: 0.00384; Resistance (Ohms): 100K; Tolerance: ±1%; Value: 100k; .Checked SCH: used; Supplier: Digikey; Supplier 1: Digi-Key; Supplier Part Number 1: RMCF0402FT100KCT-ND; RoHS: RoHS Compliant; Stock 1: 95; Pricing 1: 1=0.04, 10=0.025, 50=0.0138, 100=0.0105, 250=0.0078, 500=0.00576, 1000=0.00384 (USD); Composition: Thick Film; Features: -; Size / Dimension: 0.039" L x 0.020" W (1.00mm x 0.50mm); Height: 0.016" (0.40mm); Number of Terminations: 2; Packaging: Cut Tape (CT); ComponentLink1URL: http://www.seielect.com/Catalog/SEI-RMCF.pdf; ComponentLink1Description: http://www.seielect.com/Catalog/SEI-RMCF.pdf
R78 = RC0402FR-071KL: RES 1.00K OHM 1/16W 1% 0402 SMD; Manufacturer: Yageo; Power (Watts): 0.063W, 1/16W; .Checked PCB: used; Temperature Coefficient: ±100ppm/°C; Category: Resistors; Supplier Part Number: 311-1.00KLRCT-ND; Manufacturer Part Number: RC0402FR-071KL; Package / Case: 0402 (1005 Metric); Price 1k [$]: 0.01421; Resistance (Ohms): 1K; Tolerance: ±1%; Value: 1k; .Checked SCH: used; Supplier: Digikey; Supplier 1: Digi-Key; Supplier Part Number 1: 311-1.00KLRCT-ND; RoHS: RoHS Compliant; Stock 1: 1753477; Pricing 1: 10=0.014, 50=0.0104, 100=0.0079, 250=0.00584, 500=0.00432, 1000=0.00288 (USD); Composition: Thick Film; Features: -; Size / Dimension: 0.039" L x 0.020" W (1.00mm x 0.50mm); Height: 0.016" (0.40mm); Number of Terminations: 2; Packaging: Cut Tape (CT); ComponentLink1URL: http://www.yageo.com/documents/recent/PYu-RC0402_51_RoHS_L_6.pdf; ComponentLink1Description: http://www.yageo.com/documents/recent/PYu-RC0402_51_RoHS_L_6.pdf
R81 = RC0402FR-0712KL: RES 12.0K OHM 1/16W 1% 0402 SMD; Manufacturer: Yageo; Power (Watts): 0.063W, 1/16W; .Checked PCB: used; Temperature Coefficient: ±100ppm/°C; Category: Resistors; Supplier Part Number: 311-12.0KLRCT-ND; Manufacturer Part Number: RC0402FR-0712KL; Package / Case: 0402 (1005 Metric); Price 1k [$]: 0.01421; Resistance (Ohms): 12K; Tolerance: ±1%; Value: 12k; .Checked SCH: used; Supplier: Digikey; Supplier 1: Digi-Key; Supplier Part Number 1: 311-12.0KLRCT-ND; RoHS: RoHS Compliant; Stock 1: 526086; Pricing 1: 10=0.014, 50=0.0104, 100=0.0079, 250=0.00584, 500=0.00432, 1000=0.00288 (USD); Composition: Thick Film; Features: -; Size / Dimension: 0.039" L x 0.020" W (1.00mm x 0.50mm); Height: 0.016" (0.40mm); Number of Terminations: 2; Packaging: Cut Tape (CT); ComponentLink1URL: http://www.yageo.com/documents/recent/PYu-RC0402_51_RoHS_L_6.pdf; ComponentLink1Description: http://www.yageo.com/documents/recent/PYu-RC0402_51_RoHS_L_6.pdf
U11 U12 = MIC2026-1YM TR: IC SW DISTRIBUTION 2CHAN 8SOIC; Manufacturer: Micrel Inc; .Checked PCB: used; Number of Outputs: 2; Rds (On): 140 mOhm; Internal Switch(s): Yes; Current Limit: 900mA; Voltage - Input: 2.7 V ~ 5.5 V; .Checked SCH: used; Category: Integrated Circuits (ICs); Family: PMIC - Power Distribution Switches; Manufacturer Part Number: MIC2026-1YM TR; Operating Temperature: -40°C ~ 85°C; Package / Case: 8-SOIC (0.154", 3.90mm Width); Price 1k [$]: 0.53200; Supplier: Digikey; Supplier Part Number: 576-1059-1-ND; Value: MIC2026-1YM TR; Supplier 1: Digi-Key; Supplier Part Number 1: 576-1059-1-ND; RoHS: RoHS Compliant; Stock 1: 44857; Pricing 1: 1=1.14, 25=0.95, 100=0.76, 250=0.57, 500=0.532 (USD); Type: High Side Switch; Mounting Type: Surface Mount; Supplier Device Package: 8-SOIC; Packaging: Cut Tape (CT); ComponentLink1URL: http://www.micrel.com/_PDF/mic2026.pdf; ComponentLink1Description: http://www.micrel.com/_PDF/mic2026.pdf
U13 = USB2514BI-AEZG: USB HUB CONT IND TEMP 36QFNE3; Manufacturer: Microchip Technology; Function: Hub Controller; Standards: USB 2.0; Voltage - Supply: 3 V ~ 3.6 V; Current - Supply: 85mA; .Creator: MM; Supplier 1: Digi-Key; Manufacturer Part Number: USB2514BI-AEZG; RoHS: RoHS Compliant; Category: Integrated Circuits (ICs); Stock 1: 1662; Pricing 1: 1=3.78, 10=3.26, 25=2.72, 100=2.47 (USD); Packaging: Tube; Protocol: USB; Interface: USB; Operating Temperature: -40°C ~ 85°C; Package / Case: 36-TQFN Exposed Pad; Supplier Device Package: 36-QFN-EP (6x6); ComponentLink1URL: http://www.smsc.com/Downloads/SMSC/Downloads_Public/Data_Sheets/251xb.pdf; ComponentLink1Description: http://www.smsc.com/Downloads/SMSC/Downloads_Public/Data_Sheets/251xb.pdf; Supplier Part Number 1: USB2514BI-AEZG-ND; .Checked PCB: MM; .Checked SCH: MM
Y2 = ABM7-24.000MHZ-D-2-Y-T: CRYSTAL 24.0000MHZ 18PF SMD; Manufacturer: Abracon Corporation; Frequency Stability: ±30ppm; Frequency Tolerance: ±20ppm; ESR (Equivalent Series Resistance): 50 Ohm; Operating Mode: Fundamental; .Creator: MM; .Checked PCB: RF, used by MM; .Checked SCH: MM, checked by RF; Supplier 1: Digi-Key; Manufacturer Part Number: ABM7-24.000MHZ-D-2-Y-T; RoHS: RoHS Compliant; Category: Crystals and Oscillators; Stock 1: 53059; Pricing 1: 1=1.31, 10=1.138, 50=0.9976, 100=0.7875, 500=0.665 (USD); Type: MHz Crystal; Frequency: 24MHz; Load Capacitance: 18pF; Operating Temperature: -40°C ~ 85°C; Ratings: -; Mounting Type: Surface Mount; Package / Case: 2-SMD; Size / Dimension: 0.236" L x 0.138" W (6.00mm x 3.50mm); Height: 0.055" (1.40mm); Packaging: Cut Tape (CT); ComponentLink1URL: http://www.abracon.com/Resonators/abm7.pdf; ComponentLink1Description: http://www.abracon.com/Resonators/abm7.pdf; Supplier Part Number 1: 535-9845-1-ND

## Sheet [10] - ETHERNET.SchDoc
size A3; DocumentNumber: 2; SheetNumber: 10; SheetTotal: 20
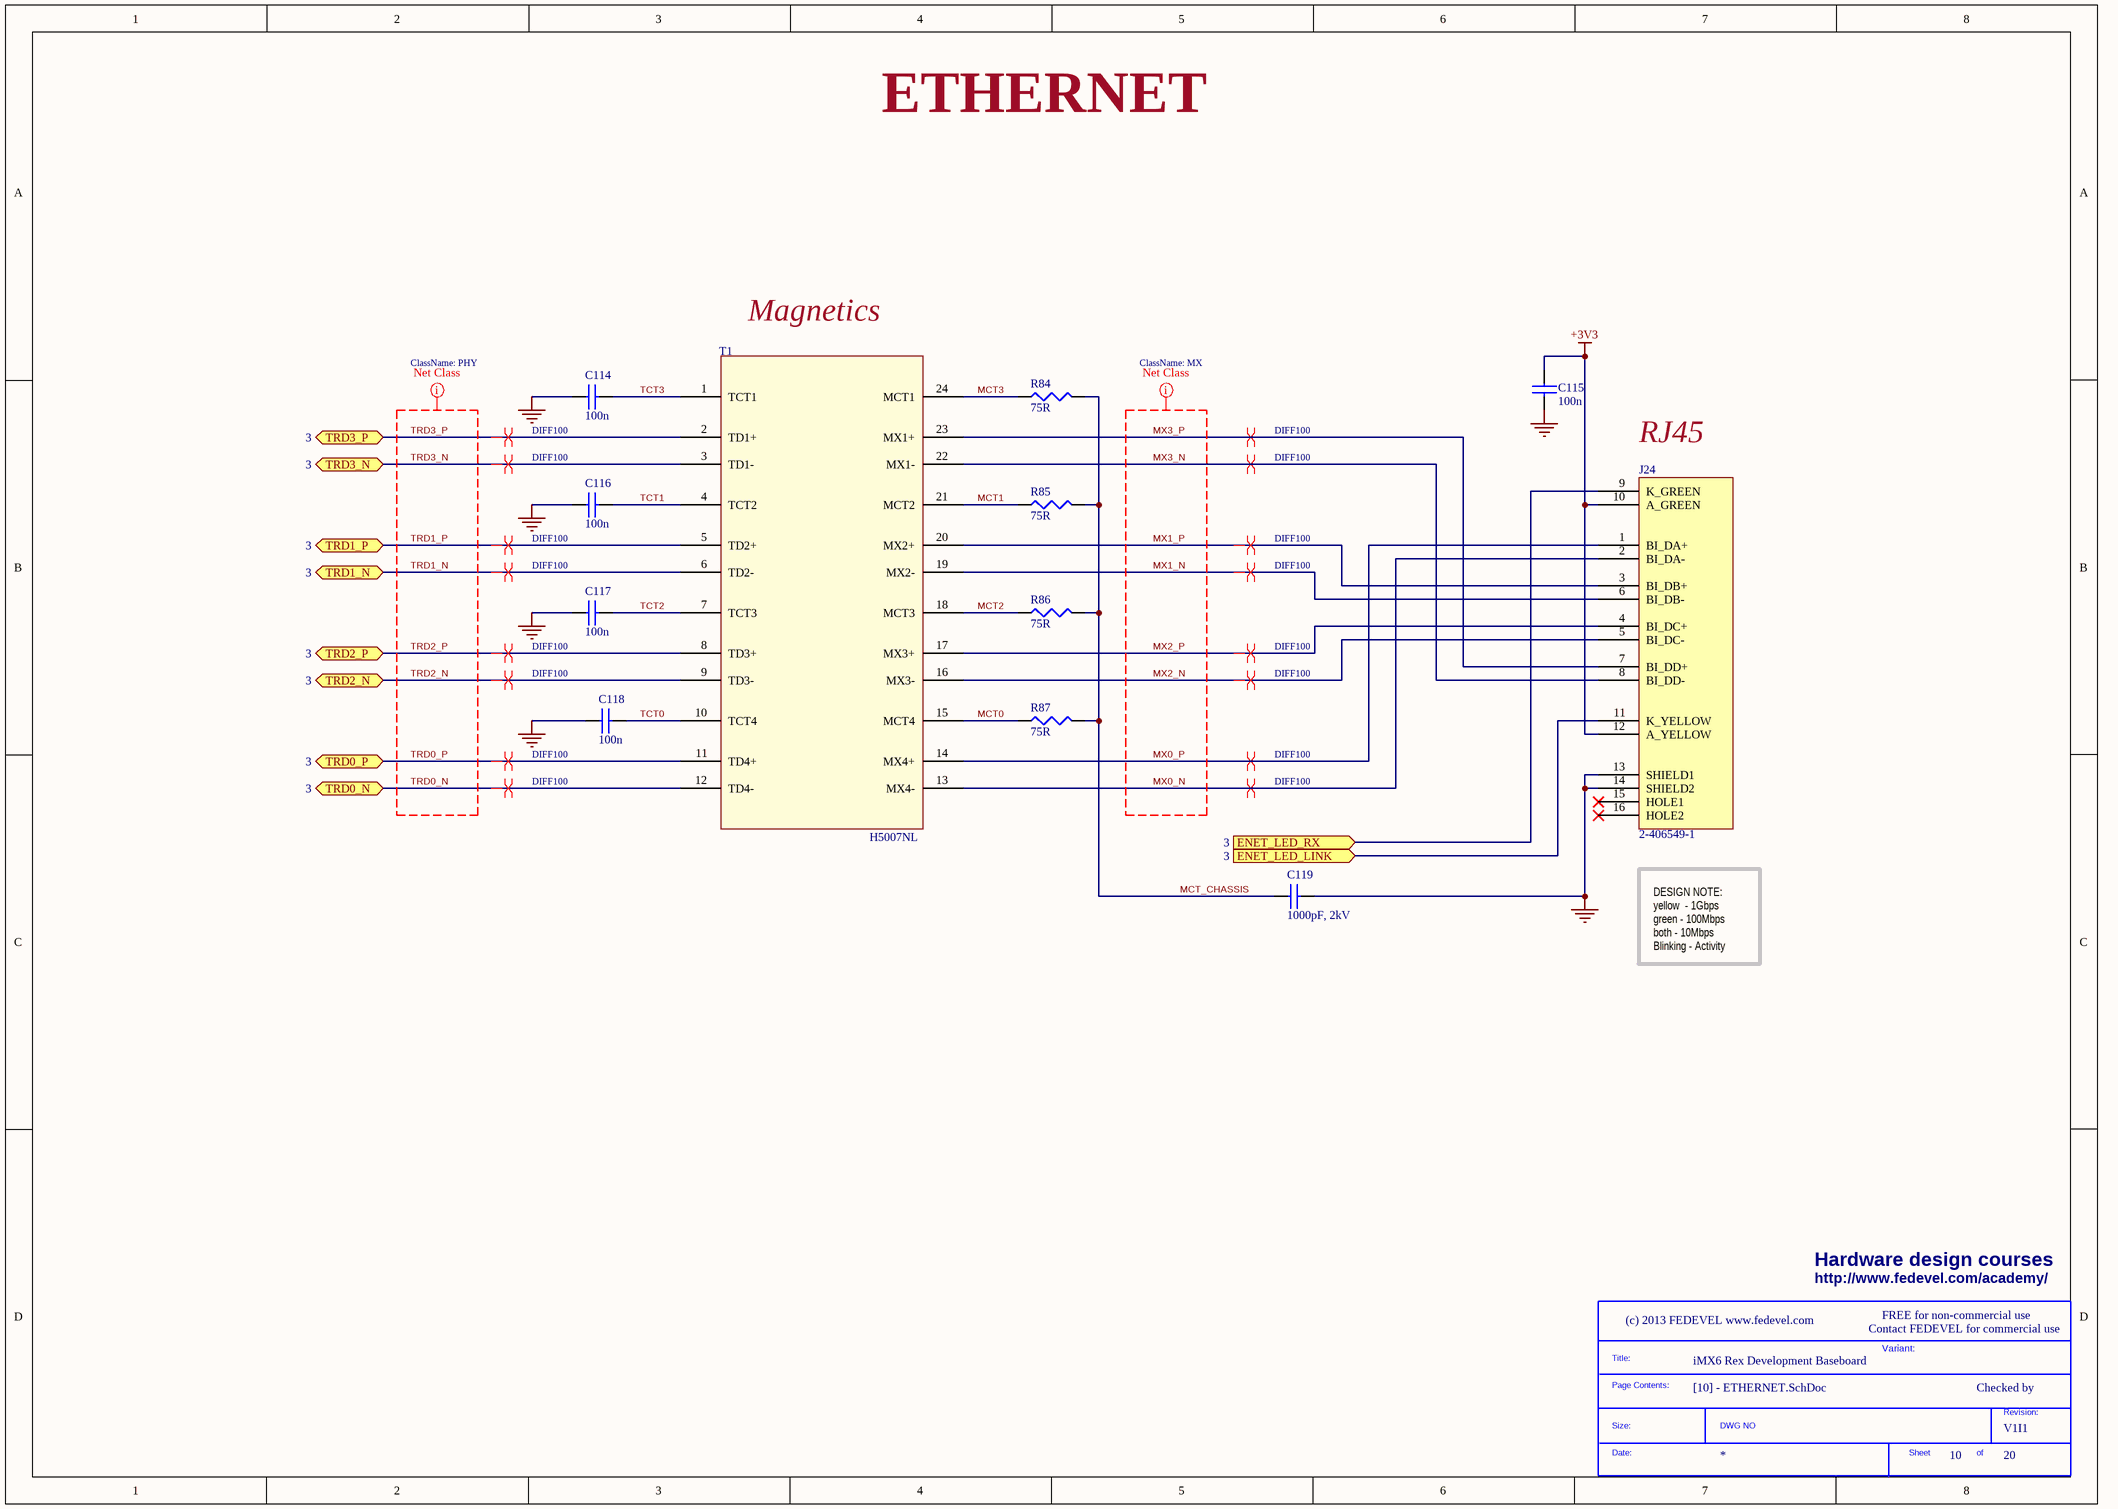
[diagram p6: [10] - ETHERNET.SchDoc]

### Parts
(Parts that share a designator on the sheet are numbered #1, #2 ... from top to bottom, then left to right.)
*#5  SDTitleBlock  (value not drawn)  (graphical)
C114  100n  [C0402]
C115  100n  [C0402]
C116  100n  [C0402]
C117  100n  [C0402]
C118  100n  [C0402]
C119  1000pF, 2kV  [C1206]
J24  2-406549-1  [RJ45LED]
R84  75R  [R0402]
R85  75R  [R0402]
R86  75R  [R0402]
R87  75R  [R0402]
T1  H5007NL  [H5007NL]

### Ports
ENET_LED_LINK (in, see 3), ENET_LED_RX (in, see 3), TRD0_N (bidir, see 3), TRD0_P (bidir, see 3), TRD1_N (bidir, see 3), TRD1_P (bidir, see 3), TRD2_N (bidir, see 3), TRD2_P (bidir, see 3), TRD3_N (bidir, see 3), TRD3_P (bidir, see 3)

### Nets
+3V3: C115.1 J24.10(A_GREEN) J24.12(A_YELLOW)
GND: C114.1 C115.2 C116.1 C117.1 C118.1 C119.2 J24.13(SHIELD1) J24.14(SHIELD2)
ENET_LED_LINK: J24.11(K_YELLOW) ; port ENET_LED_LINK
ENET_LED_RX: J24.9(K_GREEN) ; port ENET_LED_RX
MCT0: R87.1 T1.15(MCT4)
MCT1: R85.1 T1.21(MCT2)
MCT2: R86.1 T1.18(MCT3)
MCT3: R84.1 T1.24(MCT1)
MCT_CHASSIS: C119.1 R84.2 R85.2 R86.2 R87.2
MX0_N: J24.2(BI_DA-) T1.13(MX4-)
MX0_P: J24.1(BI_DA+) T1.14(MX4+)
MX1_N: J24.6(BI_DB-) T1.19(MX2-)
MX1_P: J24.3(BI_DB+) T1.20(MX2+)
MX2_N: J24.5(BI_DC-) T1.16(MX3-)
MX2_P: J24.4(BI_DC+) T1.17(MX3+)
MX3_N: J24.8(BI_DD-) T1.22(MX1-)
MX3_P: J24.7(BI_DD+) T1.23(MX1+)
TCT0: C118.2 T1.10(TCT4)
TCT1: C116.2 T1.4(TCT2)
TCT2: C117.2 T1.7(TCT3)
TCT3: C114.2 T1.1(TCT1)
TRD0_N: T1.12(TD4-) ; port TRD0_N
TRD0_P: T1.11(TD4+) ; port TRD0_P
TRD1_N: T1.6(TD2-) ; port TRD1_N
TRD1_P: T1.5(TD2+) ; port TRD1_P
TRD2_N: T1.9(TD3-) ; port TRD2_N
TRD2_P: T1.8(TD3+) ; port TRD2_P
TRD3_N: T1.3(TD1-) ; port TRD3_N
TRD3_P: T1.2(TD1+) ; port TRD3_P

Not connected (* = marked no-connect by the designer): J24 15(HOLE1)* 16(HOLE2)*

### Layout directives
differential pair; net class DIFF100: MX0_N, MX0_P, MX1_N, MX1_P, MX2_N, MX2_P, MX3_N, MX3_P, TRD0_N, TRD0_P, TRD1_N, TRD1_P, TRD2_N, TRD2_P, TRD3_N, TRD3_P
net class PHY: TRD0_N, TRD0_P, TRD1_N, TRD1_P, TRD2_N, TRD2_P, TRD3_N, TRD3_P
net class MX: MX0_N, MX0_P, MX1_N, MX1_P, MX2_N, MX2_P, MX3_N, MX3_P

### Notes on the sheet
- ETHERNET
- Magnetics
- (near J24) RJ45
- DESIGN NOTE:
  yellow  - 1Gbps
  green - 100Mbps
  both - 10Mbps
  Blinking - Activity
- Hardware design courses
- http://www.fedevel.com/academy/
- Contact FEDEVEL for commercial use
- FREE for non-commercial use
- Variant:
- Checked by
- (in symbol SDTitleBlock) Title:; Page Contents:; Revision:; Size:; DWG NO; Date:; Sheet; of

### Library data of the parts
C114-C118 = C1005X5R1H104K: as C86 on sheet [09] - USB; Category: Capacitors; Supplier Part Number: 445-5942-1-ND; Manufacturer Part Number: C1005X5R1H104K; Operating Temperature: -55°C ~ 85°C; Package / Case: 0402 (1005 Metric); Price 1k [$]: 0.02340; .Checked SCH: used; Voltage - Rated: 50V; Supplier: Digikey; Supplier 1: Digi-Key; Supplier Part Number 1: 445-5942-1-ND; RoHS: RoHS Compliant; Stock 1: 106926; Pricing 1: 1=0.27, 10=0.18, 100=0.072, 250=0.05176, 500=0.0369, 1000=0.027 (USD); Tolerance: ±10%; Temperature Coefficient: X5R; Mounting Type: Surface Mount, MLCC; Applications: General Purpose; Ratings: -; Size / Dimension: 0.039" L x 0.020" W (1.00mm x 0.50mm); Height - Seated (Max): -; Thickness (Max): 0.022" (0.55mm); Lead Spacing: -; Features: -; Packaging: Cut Tape (CT); Lead Style: -; ComponentLink1URL: http://www.tdk.co.jp/tefe02/e412_c.pdf; ComponentLink1Description: http://www.tdk.co.jp/tefe02/e412_c.pdf
C119 = C1206X102KGRACTU: CAP CER 1000PF 2000V X7R 1206 FT; Manufacturer: Kemet; .Checked PCB: used; Voltage - Rated: 2000V (2kV); Description: CAP CER 1000PF 2KV 10% X7R 1206; Tolerance: ±10%; Capacitance: 1000pF; Category: Capacitors; Supplier Part Number: 399-5830-1-ND; Manufacturer Part Number: C1206X102KGRACTU; Operating Temperature: -55°C ~ 125°C; Package / Case: 1206 (3216 Metric); Price 1k [$]: 0.27600; Value: 1000pF, 2kV; .Checked SCH: used; Supplier: Digikey; Supplier 1: Digi-Key; Supplier Part Number 1: 399-5830-1-ND; RoHS: RoHS Compliant; Stock 1: 2068; Pricing 1: 1=0.92, 10=0.771, 25=0.6324, 100=0.483, 250=0.37952, 500=0.345, 1000=0.276 (USD); Temperature Coefficient: X7R; Mounting Type: Surface Mount, MLCC; Applications: Boardflex Sensitive; Ratings: -; Size / Dimension: 0.134" L x 0.063" W (3.40mm x 1.60mm); Height - Seated (Max): -; Thickness (Max): 0.069" (1.75mm); Lead Spacing: -; Features: Soft Termination, High Voltage; Packaging: Cut Tape (CT); Lead Style: -; ComponentLink1URL: http://www.kemet.com/kemet/web/homepage/kechome.nsf/weben/8311688D32A99EF8852578B500644843/$file/KEM_CC105_HIVOLT.pdf; ComponentLink1Description: http://www.kemet.com/kemet/web/homepage/kechome.nsf/weben/8311688D32A99EF8852578B500644843/$file/KEM_CC105_HIVOLT.pdf
J24 = 2-406549-1: CONN MOD JACK 8POS R/A G-Y PCB; Manufacturer: Tyco; .Checked PCB: used; Number of Positions: 8p8c (RJ45, Ethernet); Description: CONN MOD JACK 8POS R/A Y-G PCB; Number of Ports: 1; Shielding: Shielded, EMI Finger; Ratings: Cat5; LED Color: Yellow - Green; Tab Direction: Up; .Checked SCH: used; Category: Connectors, Interconnects; Connector Type: Jack; Manufacturer Part Number: 2-406549-1; Price 1k [$]: 1.73278; Supplier: Digikey; Supplier Part Number: A97715-ND; Value: 2-406549-1; Supplier 1: Digi-Key; Supplier Part Number 1: A97715-ND; RoHS: RoHS Compliant; Stock 1: 9021; Pricing 1: 1=3.42 (USD); Number of Positions/Contacts: 8p8c (RJ45, Ethernet); Number of Rows: 1; Mounting Type: Through Hole; Orientation: 90° Angle (Right); Termination: Solder; Features: Board Lock; Packaging: Tray; Housing Material: Thermoplastic; Contact Material: Phosphor Bronze; Contact Finish: Gold; Operating Temperature: -40°C ~ 85°C; ComponentLink1URL: http://documents.tycoelectronics.com/commerce/DocumentDelivery/DDEController?Action=srchrtrv&DocNm=406549&DocType=CD&DocLang=EN; ComponentLink1Description: http://documents.tycoelectronics.com/commerce/DocumentDelivery/DDEController?Action=srchrtrv&DocNm=406549&DocType=CD&DocLang=EN
R84-R87 = RC0402FR-0775RL: RES 75.0 OHM 1/16W 1% 0402 SMD; Manufacturer: Yageo; Resistance (Ohms): 75; Power (Watts): 0.063W, 1/16W; .Checked PCB: used; Temperature Coefficient: ±100ppm/°C; Category: Resistors; Supplier Part Number: 311-75.0LRCT-ND; Manufacturer Part Number: RC0402FR-0775RL; Package / Case: 0402 (1005 Metric); Price 1k [$]: 0.00288; Tolerance: ±1%; Value: 75R; .Checked SCH: used; Supplier: Digikey; Supplier 1: Digi-Key; Supplier Part Number 1: 311-75.0LRCT-ND; RoHS: RoHS Compliant; Stock 1: 0; Pricing 1: 10=0.014, 50=0.0104, 100=0.0079, 250=0.00584, 500=0.00432, 1000=0.00288 (USD); Composition: Thick Film; Features: -; Size / Dimension: 0.039" L x 0.020" W (1.00mm x 0.50mm); Height: 0.016" (0.40mm); Number of Terminations: 2; Packaging: Cut Tape (CT); ComponentLink1URL: http://www.yageo.com/documents/recent/PYu-RC0402_51_RoHS_L_6.pdf; ComponentLink1Description: http://www.yageo.com/documents/recent/PYu-RC0402_51_RoHS_L_6.pdf
T1 = H5007NL: MODULE SINGLE GIGABIT LAN 24SOIC; Manufacturer: PULSE ELECTRONICS CORPORATION; .Checked PCB: MM; Transformer Type: Isolation and Data Interface (Encapsulated); Turns Ratio - Primary:Secondary: 1CT : 1CT; Category: Transformers; Family: Pulse; Manufacturer Part Number: H5007NL; Operating Temperature: 0°C ~ 70°C; Price 1k [$]: 3.25125; Supplier: Digikey; Supplier Part Number: 553-1334-ND; .Checked SCH: MM; Supplier 1: Digi-Key; Supplier Part Number 1: 553-1334-ND; RoHS: RoHS Compliant; Stock 1: 15654; Pricing 1: 1=5.74, 10=5.1, 100=4.08, 250=3.69752, 500=3.50626, 1000=3.25125, 5000=3.162 (USD); Inductance: -; E.T.: -; Mounting Type: Surface Mount; Size / Dimension: 17.53mm L x 12.20mm W; Height - Seated (Max): 5.76mm; ComponentLink1URL: http://ww2.pulseeng.com/products/datasheets/HC500.pdf; ComponentLink1Description: http://ww2.pulseeng.com/products/datasheets/HC500.pdf